# EAGLE design avr_lag2 (EAGLE 5.07)
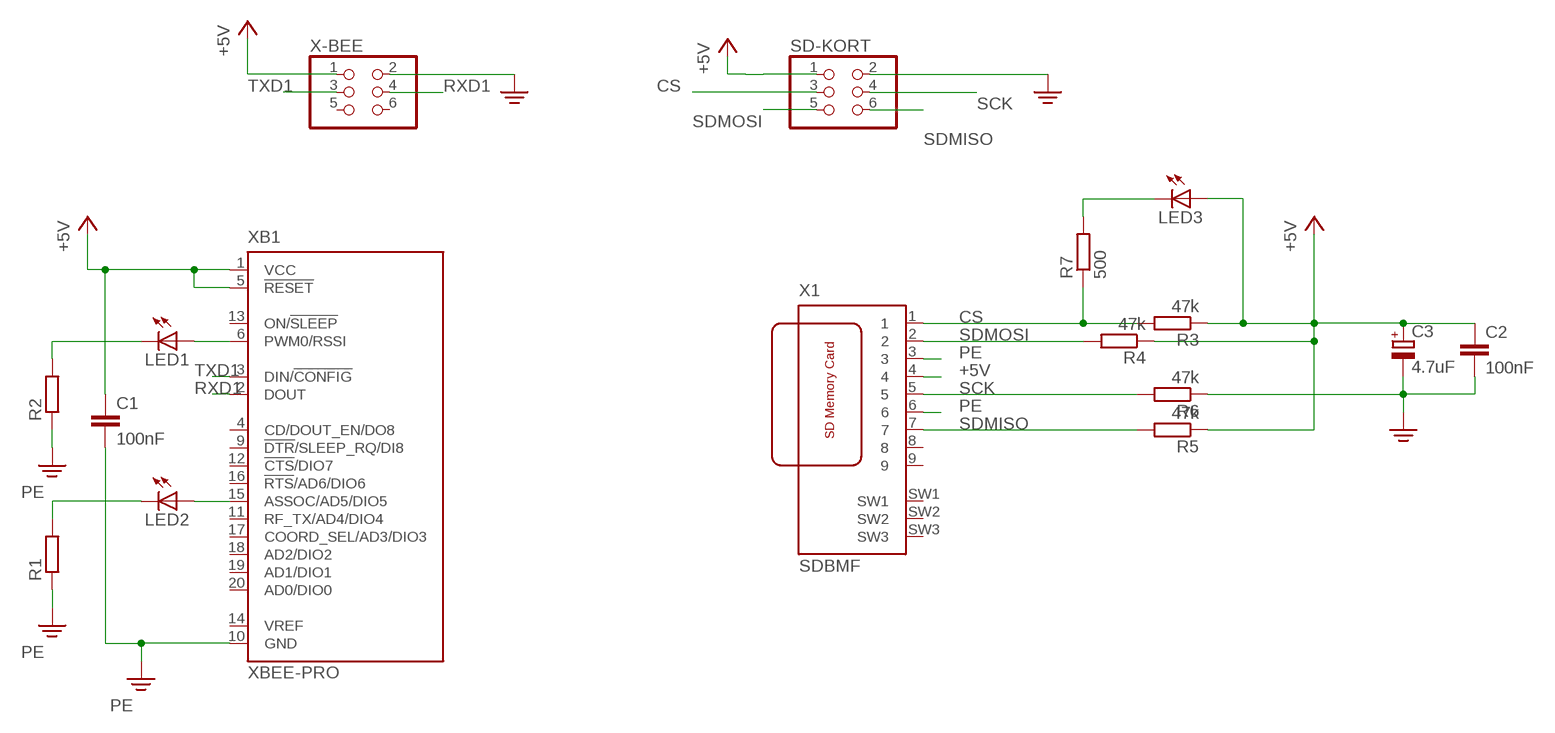
[diagram p0: schematic, sheet 1]

## Parts
C1  100nF  C-EU050-024X044  [C050-024X044]
C2  100nF  C-EU050-024X044  [C050-024X044]
C3  4.7uF  CPOL-EUE15-5AXIAL  [E15-5]
LED1  LED3MM  [LED3MM]
LED2  LED3MM  [LED3MM]
LED3  LED3MM  [LED3MM]
R1  R-EU_0207/10  [0207/10]
R2  R-EU_0207/10  [0207/10]
R3  47k  R-EU_0207/10  [0207/10]
R4  47k  R-EU_0207/10  [0207/10]
R5  47k  R-EU_0207/10  [0207/10]
R6  47k  R-EU_0207/10  [0207/10]
R7  500  R-EU_0207/10  [0207/10]
SD-KORT  PINHD-2X3  [2X03]
X1  SDBMF  [SDBMF-009XXBXX2]
X-BEE  PINHD-2X3  [2X03]
XB1  XBEE-PRO  [XBEE-PRO]

## Nets
+5V: C1.1 C2.1 C3.+ LED3.A R3.1 R4.1 R5.1 SD-KORT.1 X1.4 X-BEE.1 XB1.1(VCC) XB1.5(!RESET)
CS: R3.2 R7.1 SD-KORT.3 X1.1
N$1: LED1.K(C) R2.2
N$2: LED1.A XB1.6(PWM0/RSSI)
N$5: LED2.A XB1.15(ASSOC/AD5/DIO5)
N$6: LED2.K(C) R1.2
N$9: LED3.K(C) R7.2
PE: C1.2 C2.2 C3.- R1.1 R2.1 R6.1 SD-KORT.2 X1.3 X1.6 X-BEE.2 XB1.10(GND)
RXD1: X-BEE.4 XB1.2(DOUT)
SCK: R6.2 SD-KORT.4 X1.5
SDMISO: R5.2 SD-KORT.6 X1.7
SDMOSI: R4.2 SD-KORT.5 X1.2
TXD1: X-BEE.3 XB1.3(DIN/!CONFIG)
Unconnected: X1.8 X1.9 X1.SW1 X1.SW2 X1.SW3 X-BEE.5 X-BEE.6 XB1.4(CD/DOUT_EN/DO8) XB1.9(!DTR!/SLEEP_RQ/DI8) XB1.11(RF_TX/AD4/DIO4) XB1.12(!CTS!/DIO7) XB1.13(ON/!SLEEP) XB1.14(VREF) XB1.16(!RTS!/AD6/DIO6) XB1.17(COORD_SEL/AD3/DIO3) XB1.18(AD2/DIO2) XB1.19(AD1/DIO1) XB1.20(AD0/DIO0)

## Library data of the parts
C1 C2 = resistor:C-EU: CAPACITOR, European symbol
C3 = rcl:CPOL-EU: POLARIZED CAPACITOR, European symbol
LED1-LED3 = led:LED: LED OSRAM: - CHIPLED LG R971, LG N971, LY N971, LG Q971, LY Q971, LO R971, LY R971 LH N974, LH R974 LS Q976, LO Q976, LY Q976 LO Q996 - Hyper CHIPLED LW Q18S LB Q993, LB Q99A, LB R99A - SideLED LS A670, LO A670, LY A670, LG A670, LP A670 LB A673, LV A673, LT A673, LW A673 LH A674 LY A675 LS A676, LA A676, LO A676, LY A676, LW A676 LS A679, LY A679, LG A679 - Hyper Micro SIDELED® LS Y876, LA Y876, LO Y876, LY Y876 LT Y87S - SmartLED LW L88C, LW L88S LB L89C, LB L89S, LG L890 LS L89K, LO L89K, LY L89K LS L896, LA L896, LO L896, LY L896 - TOPLED LS T670, LO T670, LY T670, LG T670, LP T670 LSG T670, LSP T670, LSY T670, LOP T670, LYG T670 LG T671, LOG T671, LSG T671 LB T673, LV T673, LT T673, LW T673 LH T674 LS T676, LA T676, LO T676, LY T676, LB T676, LH T676, LSB T676, LW T676 LB T67C, LV T67C, LT T67C, LS T67K, LO T67K, LY T67K, LW E67C LS E67B, LA E67B, LO E67B, LY E67B, LB E67C, LV E67C, LT E67C LW T67C LS T679, LY T679, LG T679 LS T770, LO T770, LY T770, LG T770, LP T770 LB T773, LV T773, LT T773, LW T773 LH T774 LS E675, LA E675, LY E675, LS T675 LS T776, LA T776, LO T776, LY T776, LB T776 LHGB T686 LT T68C, LB T68C - Hyper Mini TOPLED® LB M676 - Mini TOPLED Santana® LG M470 LS M47K, LO M47K, LY M47K Source: http://www.osram.convergy.de LUXEON: - LUMILED® LXK2-PW12-R00, LXK2-PW12-S00, LXK2-PW14-U00, LXK2-PW14-V00 LXK2-PM12-R00, LXK2-PM12-S00, LXK2-PM14-U00 LXK2-PE12-Q00, LXK2-PE12-R00, LXK2-PE12-S00, LXK2-PE14-T00, LXK2-PE14-U00 LXK2-PB12-K00, LXK2-PB12-L00, LXK2-PB12-M00, LXK2-PB14-N00, LXK2-PB14-P00, LXK2-PB14-Q00 LXK2-PR12-L00, LXK2-PR12-M00, LXK2-PR14-Q00, LXK2-PR14-R00 LXK2-PD12-Q00, LXK2-PD12-R00, LXK2-PD12-S00 LXK2-PH12-R00, LXK2-PH12-S00 LXK2-PL12-P00, LXK2-PL12-Q00, LXK2-PL12-R00 Source: www.luxeon.com KINGBRIGHT: KA-3528ASYC Source: www.kingbright.com
R1-R7 = resistor:R-EU_: RESISTOR, European symbol
SD-KORT X-BEE = pinhead:PINHD-2X3: PIN HEADER
X1 = farnell:SDBMF: SD MEMORY CARD PUSH-PUSH WITH CONNECTOR TYPE B (BIG SWUÌTCH #3) KINGFONT PRECISION INDUSTIAL CO., LTD Source: http://www.farnell.com/datasheets/74273.pdf Best.-Nr.: 9186174 Hersteller: MULTICOMP Herstellerbez.: SDBMF-00915B0T2
XB1 = maxstream:XBEE: XBee (TM) /XBee-PRO(TM) OEM RF Modules Source: MaxStream, Inc. xbee_productmanual.pdf

## Board
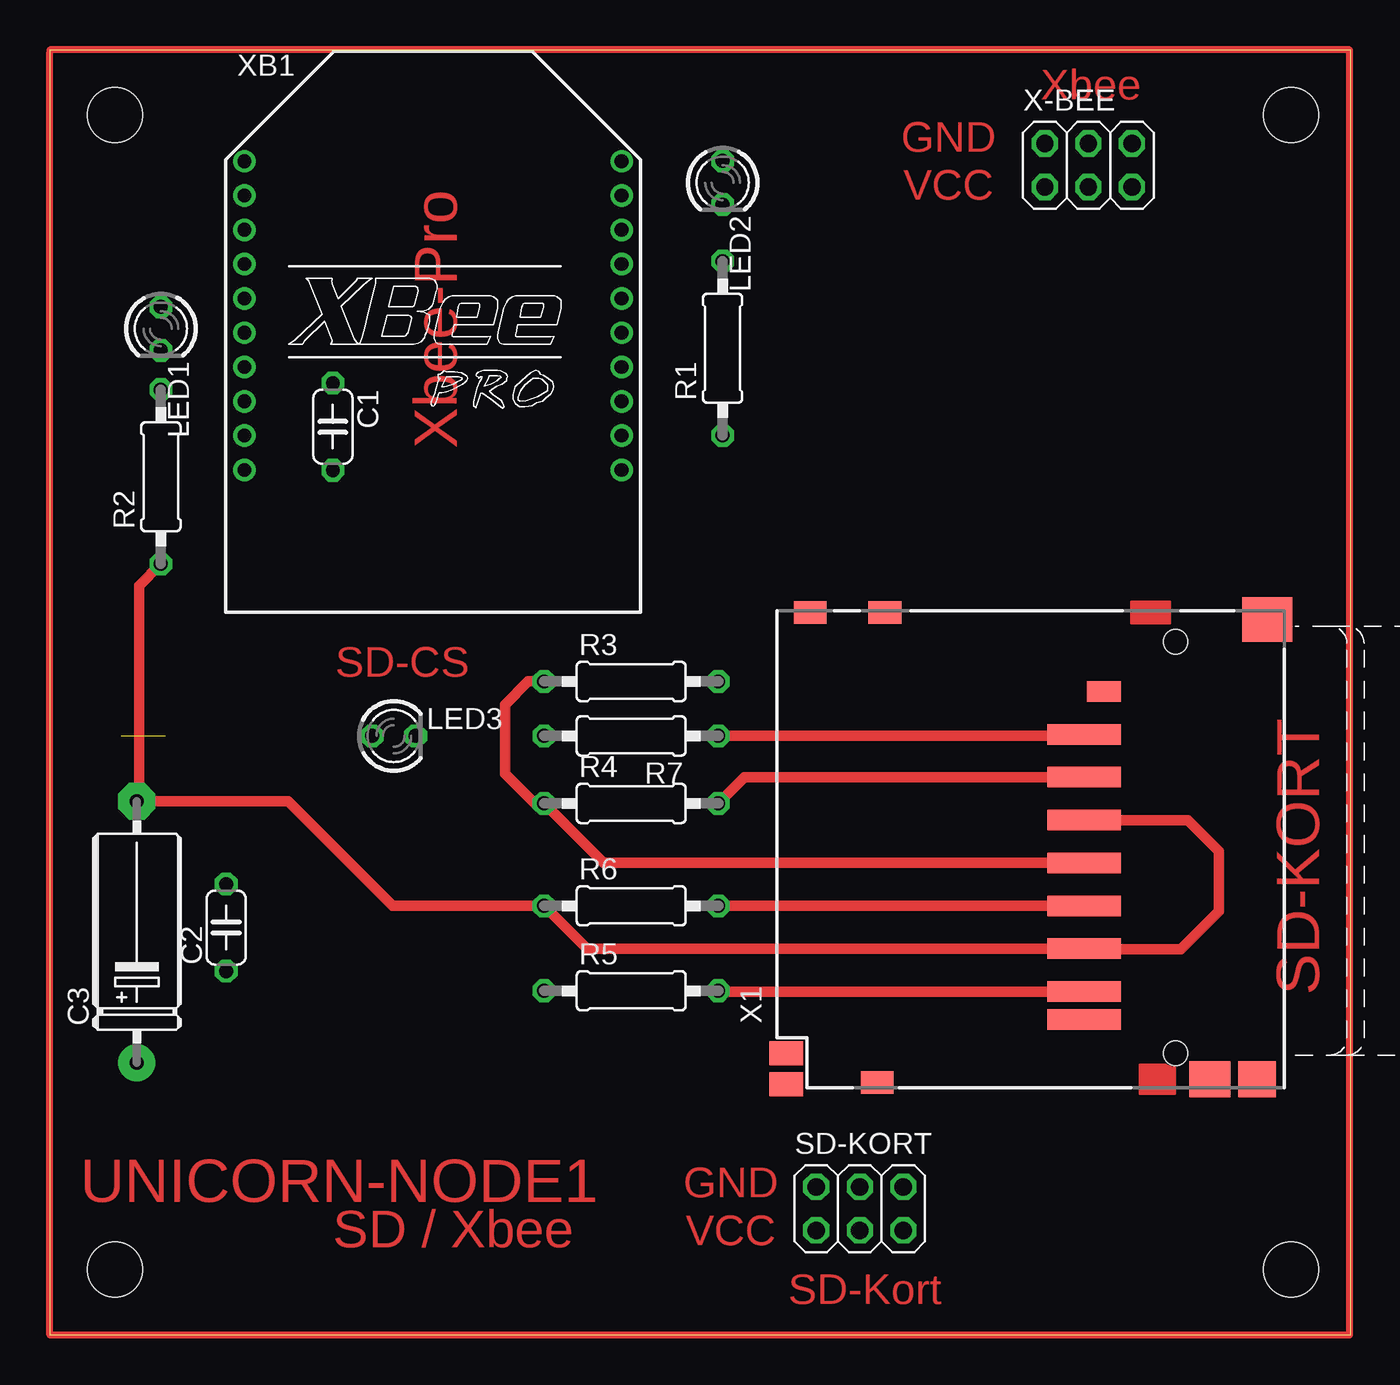
[diagram p1: board, top side]
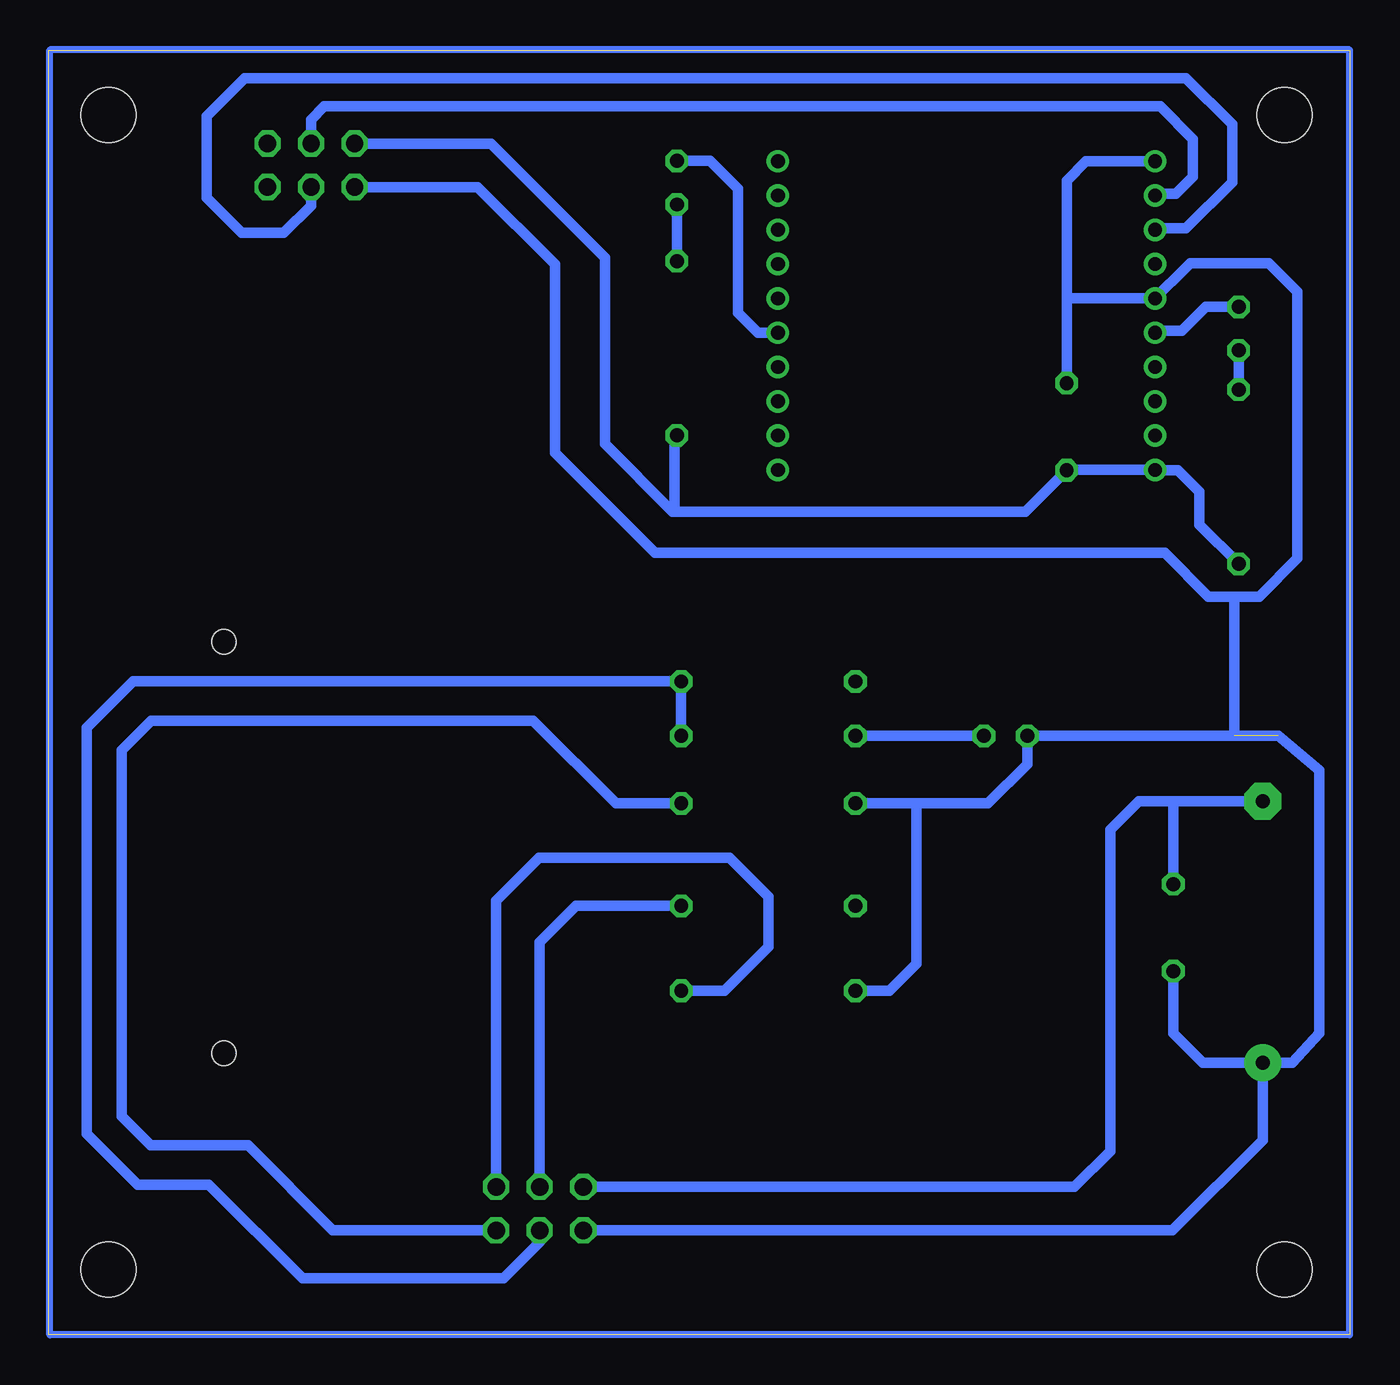
[diagram p2: board, bottom side, seen from below]

Size 75.87 x 74.92 mm. Coordinates in mm from the lower left corner, seen from the top.
Outline: 0,0 75.87,0 75.87,74.92 0,74.92 0,0
Copper layers (1*16): Top 0.035mm / dielectric 1.5mm / Bottom 0.035mm
Design rules "default": minimum track width 10mil, minimum drill 24mil, track to track 8mil, track to pad 8mil, pad to pad 8mil, via to via 8mil, smd to smd 8mil, copper to edge 40mil, drill to drill 8mil, minimum pad ring 10mil, minimum via ring 8mil, stop-mask expansion 4mil, vias tented up to drill 0mil, thermal gap 10mil
Holes 3.2 mm at 3.81,3.81 3.81,71.12 72.39,71.12 72.39,3.81

### Footprints (pad centres in the part's own frame; a part is rotated, then mirrored left to right if it is on the bottom)
C050-024X044 = drill 0.813 octagon: 1 -2.54,0; 2 2.54,0
E15-5 = drill 0.813 pad 2.159 round: + -7.62,0 | drill 0.813 pad 2.159 octagon: - 7.62,0
LED3MM = drill 0.813 octagon: A -1.27,0; K 1.27,0
0207/10 = drill 0.813 octagon: 1 -5.08,0; 2 5.08,0
2X03 = drill 1.016 octagon: 1 -2.54,-1.27; 2 -2.54,1.27; 3 0,-1.27; 4 0,1.27; 5 2.54,-1.27; 6 2.54,1.27
SDBMF-009XXBXX2 = smd 1.2 x 4.3: 1 6.7,5.325; 2 4.2,5.325; 3 1.7,5.325; 4 -0.8,5.325; 5 -3.3,5.325; 6 -5.8,5.325; 7 -8.3,5.325; 8 -9.925,5.325 | smd 1.2 x 2: 9 9.2,4.175 | smd 2.1 x 2.4: M1 -13.4,-2 | smd 2.6 x 2.9: M2 13.4,-5.35 | smd 1.3 x 1.9: M3 -13.6,17.4; M4 13.8,16.95; M5 13.8,21.3 | smd 1.4 x 1.95: SW1 -11.9,22.7; SW3 -13.7,22.7 | smd 2.1 x 2.2: SW2 -13.4,-4.75 | hole 1.4: -11.9,0; 12.1,0
XBEE-PRO = drill 0.8 pad 1.27 round: 1 -11,9; 2 -11,7; 3 -11,5; 4 -11,3; 5 -11,1; 6 -11,-1; 7 -11,-3; 8 -11,-5; 9 -11,-7; 10 -11,-9; 11 11,-9; 12 11,-7; 13 11,-5; 14 11,-3; 15 11,-1; 16 11,1; 17 11,3; 18 11,5; 19 11,7; 20 11,9

### Placement (x,y rotation side)
C1  16.51,52.96 270 top
C2  10.29,23.75 90 top
C3  5.08,23.5 90 top
LED1  6.48,58.67 270 top
LED2  39.24,67.18 270 top
LED3  20.07,34.92 0 top
R1  39.24,57.53 90 top
R2  6.48,50.04 90 top
R3  33.91,38.1 0 top
R4  33.91,30.99 0 top
R5  33.91,20.07 0 top
R6  33.91,25.02 0 top
R7  33.91,34.92 180 top
SD-KORT  47.24,7.37 0 top
X1  65.66,28.32 90 top
X-BEE  60.58,68.2 0 top
XB1  22.35,59.44 0 top

### Tracks (layer width: path | path; a pad name or v marks a point on that pad's centre or on a via)
+5V  (1 unrouted)
  Top 0.61: X1.4 32.3,27.52 R4.1 28.27,30.99 26.54,32.72 26.54,36.75 27.89,38.1 R3.1
  Bottom 0.61: 16.51,64.77 16.51,62.23 16.51,61.85 | 16.51,64.77 16.51,66.58 | XB1.1 14.65,68.44 15.38,68.44 16.51,67.31 16.51,64.77 | XB1.5 16.51,60.44 16.51,61.85 | 16.51,61.85 C1.1 | X-BEE.1 50.86,66.93 46.35,62.42 46.35,51.43 40.52,45.59 11.43,45.59 10.79,45.59 8.26,43.05 6.73,43.05 | XB1.5 11.35,60.45 | XB1.5 9.53,62.26 9.3,62.48 4.7,62.48 3.05,60.83 3.05,45.27 5.27,43.05 6.73,43.05 | C3.+ 5.08,11.35 10.34,6.1 44.83,6.1 SD-KORT.1 | C3.+ 8.58,15.88 10.29,17.58 C2.1 | R5.1 26.84,20.07 25.27,21.64 25.27,30.86 25.27,30.99 | 25.27,30.99 R4.1 | C3.+ 3.35,15.88 1.78,17.58 1.78,32.93 4.15,34.92 LED3.A 18.8,33.29 21.1,30.99 25.27,30.99 | 6.73,34.92 6.73,43.05
CS
  Top 0.61: R7.1 60.33,34.92 X1.1
  Bottom 0.61: R7.1 R3.2 70.97,38.1 73.66,35.41 73.66,11.72 70.71,8.76 66.55,8.76 61.09,3.3 49.35,3.3 47.24,5.4 SD-KORT.3
N$1
  Bottom 0.61: R2.2 LED1.K
N$2
  Bottom 0.61: LED1.A 8.38,59.94 9.78,58.55 11.35,58.55 XB1.6
N$5
  Bottom 0.61: LED2.A 37.31,68.45 35.69,66.83 35.69,59.59 34.52,58.42 33.35,58.42 XB1.15
N$6
  Bottom 0.61: R1.2 LED2.K
N$9
  Bottom 0.61: LED3.K R7.2
N$10
  Bottom 0.406: 0,74.93 75.82,74.93 75.82,0 0,0 0,74.93
N$11
  Top 0.406: 0,74.93 75.82,74.93 75.82,0 0,0 0,74.8
PE
  Top 0.61: X1.3 66.38,30.02 68.2,28.21 68.2,24.7 65.98,22.48 60.33,22.48 X1.6 31.33,22.52 R6.1 20,25.02 15.49,29.52 13.9,31.11 C3.- 5.21,31.11 5.21,43.69 R2.1
  Bottom 0.61: X-BEE.2 50.09,69.47 43.43,62.81 43.43,51.95 39.49,48.01 39.37,48.01 | 39.37,48.01 18.92,48.01 C1.2 16.51,50.44 XB1.10 11.35,50.42 10.03,50.42 8.76,49.15 8.76,47.24 R2.1 | R1.1 39.37,52.45 39.37,48.01 | 10.29,31.11 C3.- | 10.29,30.99 C2.2 | 10.29,31.11 10.29,30.99 | SD-KORT.2 16.05,8.64 13.97,10.72 13.97,29.45 12.3,31.11 10.29,31.11 | 10.29,31.11 10.29,30.99
RXD1
  Bottom 0.61: XB1.2 11.18,66.44 11.18,66.55 10.14,66.55 9.14,67.54 9.14,69.72 11.05,71.63 59.81,71.63 60.58,70.86 X-BEE.4
SCK
  Top 0.61: X1.5 39.12,25.02 R6.2
  Bottom 0.61: SD-KORT.4 47.24,22.89 45.12,25.02 R6.2
SDMISO
  Top 0.61: X1.7 38.99,20.02 R5.2
  Bottom 0.61: SD-KORT.6 49.78,25.31 47.28,27.81 36.17,27.81 33.91,25.55 33.91,22.64 36.48,20.07 R5.2
SDMOSI
  Top 0.61: R4.2 40.52,32.52 X1.2
  Bottom 0.61: R4.2 42.8,30.99 47.62,35.81 69.9,35.81 71.63,34.09 71.63,12.75 69.92,11.05 64.26,11.05 59.31,6.1 SD-KORT.5
TXD1
  Bottom 0.61: XB1.3 10.92,64.44 10.92,64.52 9.56,64.52 6.86,67.22 6.86,70.58 9.55,73.28 64.46,73.28 66.67,71.06 66.67,66.29 64.64,64.26 62.17,64.26 60.58,65.85 X-BEE.3
(copper drawn outside any net)
  shapes: Bottom circle x4, Top circle x4

### Text on the board
Top: Xbee | GND | VCC | Xbee-Pro | SD-CS | SD-KORT | UNICORN-NODE1 | GND | SD / Xbee | VCC | SD-Kort